# Altium schematic sheet lcd.SchDoc: LCD
size B; Engineer: Jacob Faucett; Organization: CUAir; Address1: L3, 12a Rodborough Rd; Address2: Frenchs Forest; Address3: NSW; Address4: Australia 2086; Revision: 1; SheetNumber: 7; SheetTotal: 9; CompetitionYear: 2025; CPN: N/A; PROJECT: Current Logging and Validation Board
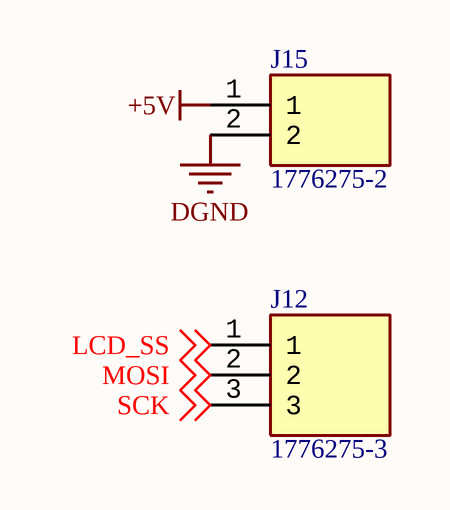
[diagram p0: lcd.SchDoc]

## Parts
J12  1776275-3  [17762753]
J15  1776275-2  [17762752]

## Nets
+5V: J15.1
DGND: J15.2
LCD_SS: J12.1 ; off-sheet LCD_SS
MOSI: J12.2 ; off-sheet MOSI
SCK: J12.3 ; off-sheet SCK

## Notes on the sheet
- Project
- Title
- Size:
- Date:
- B
- Number:
- Revision:
- File:

## Library data of the parts
J12 = 1776275-3: Connector; Manufacturer_Name: TE Connectivity; Datasheet Link: https://www.te.com/commerce/DocumentDelivery/DDEController?Action=srchrtrv&DocNm=1-1773458-1_EURO_STYLE_QRG&DocType=Data%20Sheet&DocLang=English&PartCntxt=1776275-3&DocFormat=pdf; Height: 8.3mm; Manufacturer_Part_Number: 1776275-3; Mouser Part Number: 571-1776275-3; Mouser Price/Stock: https://www.mouser.co.uk/ProductDetail/TE-Connectivity/1776275-3?qs=vnwGVgFuQiaG2mifqnUIBA%3D%3D; Arrow Part Number: 1776275-3; Arrow Price/Stock: https://www.arrow.com/en/products/1776275-3/te-connectivity?region=nac
J15 = 1776275-2: Connector; Manufacturer_Name: TE Connectivity; Datasheet Link: https://www.te.com/commerce/DocumentDelivery/DDEController?Action=srchrtrv&DocNm=1-1773458-1_EURO_STYLE_QRG&DocType=Data%20Sheet&DocLang=English&PartCntxt=1776275-2&DocFormat=pdf; Height: 8.6mm; Manufacturer_Part_Number: 1776275-2; Mouser Part Number: 571-1776275-2; Mouser Price/Stock: https://www.mouser.co.uk/ProductDetail/TE-Connectivity/1776275-2?qs=vnwGVgFuQiZz9SD%252Bziemgw%3D%3D; Arrow Part Number: 1776275-2; Arrow Price/Stock: https://www.arrow.com/en/products/1776275-2/te-connectivity?region=nac